# EAGLE design schematics (EAGLE 9.5.2)
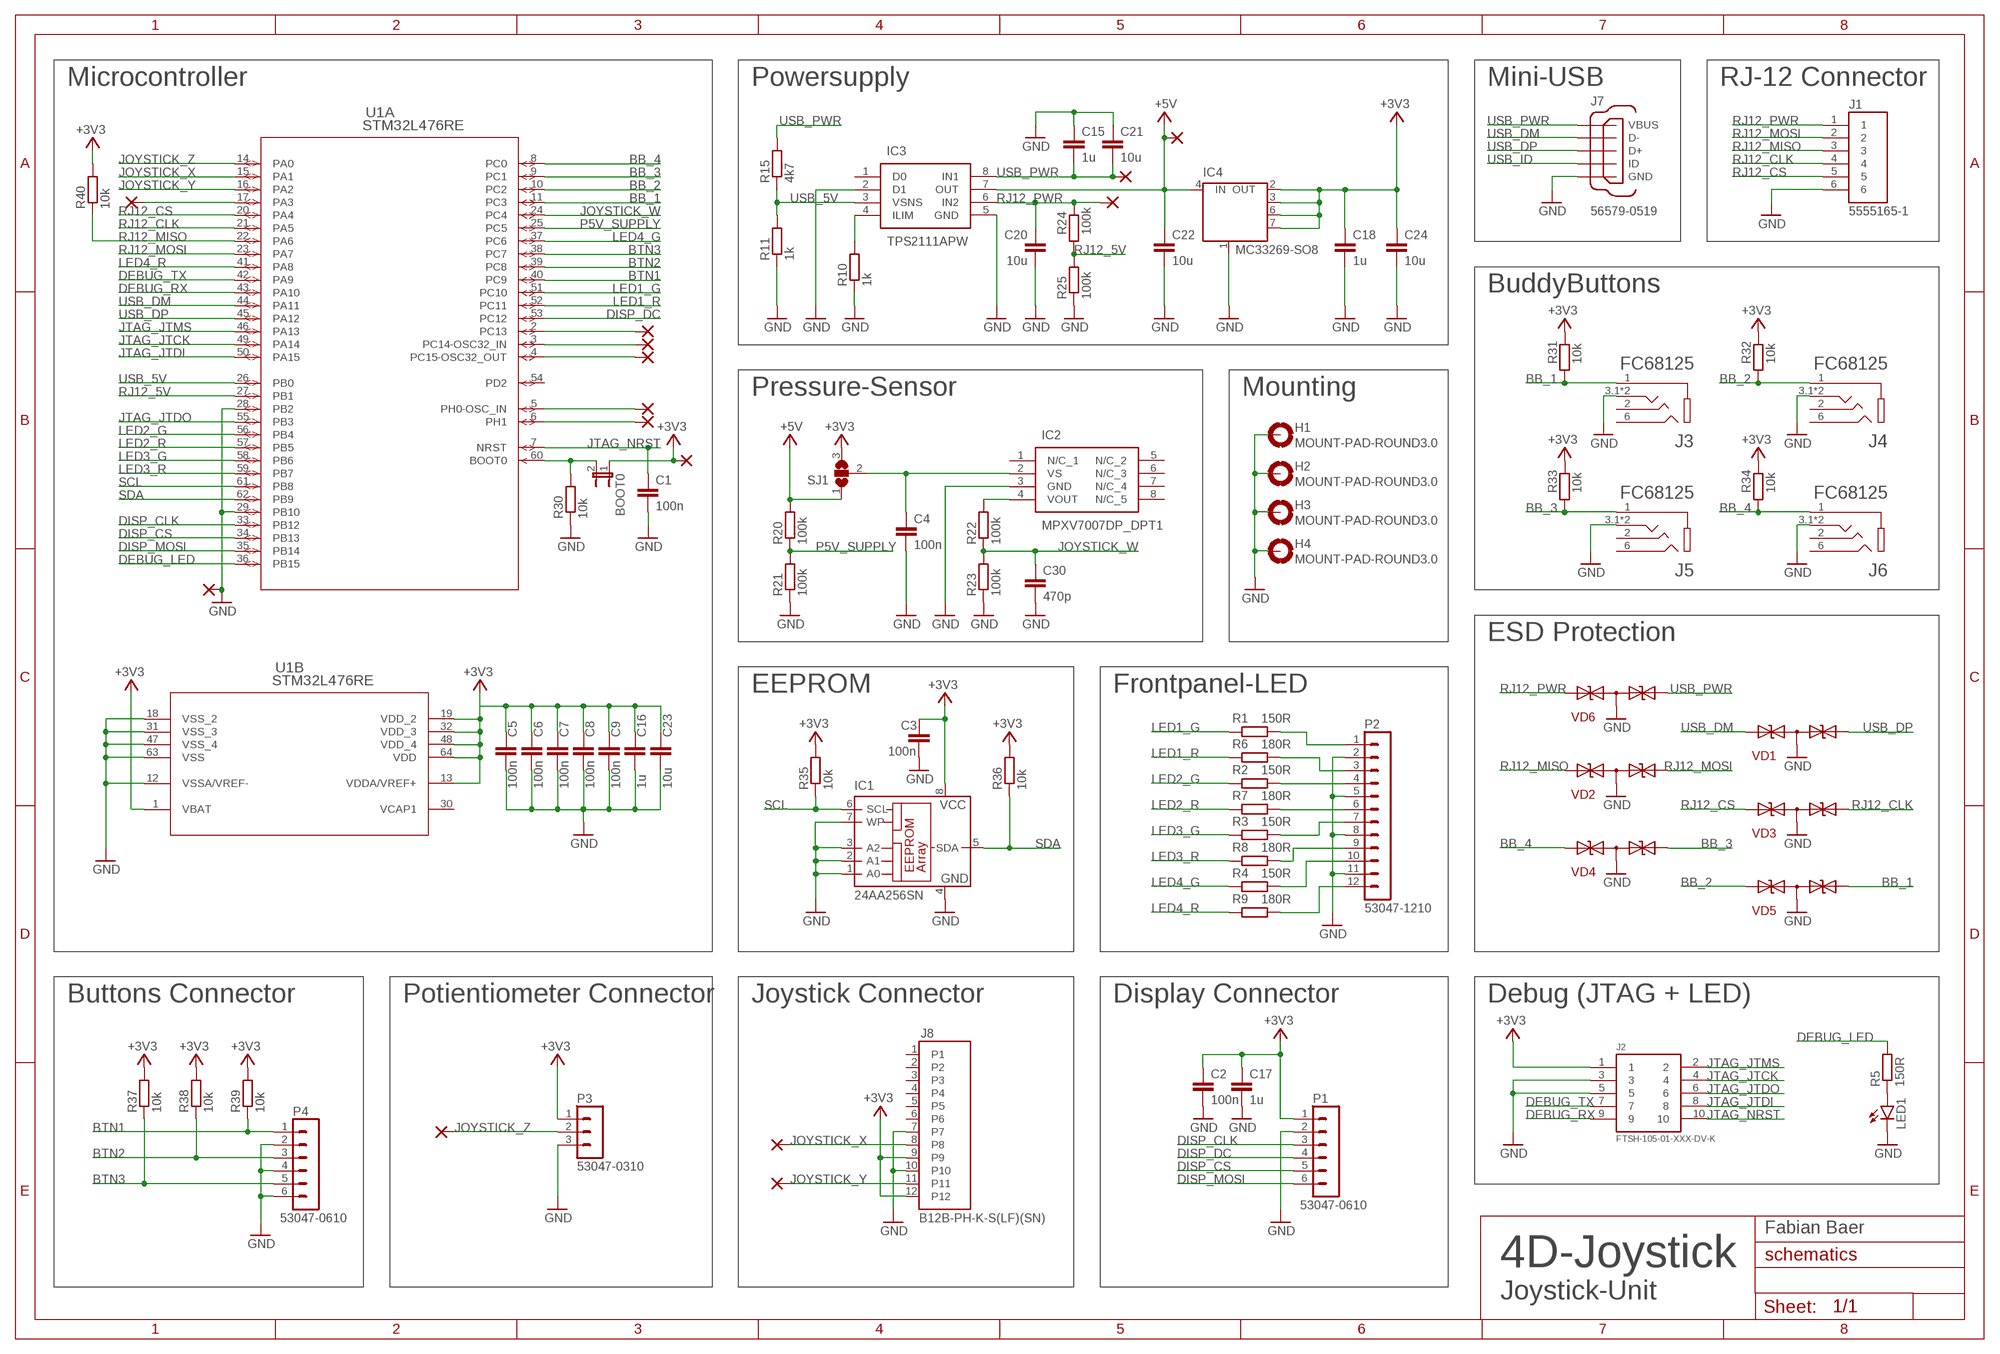
[diagram p0: schematic, sheet 1]

## Parts
BOOT0  JP1E  [JP1]
C1  100n  C-EUC0603  [C0603]
C2  100n  C-EUC0603  [C0603]
C3  100n  C-EUC0603  [C0603]
C4  100n  C-EUC0603  [C0603]
C5  100n  C-EUC0603  [C0603]
C6  100n  C-EUC0603  [C0603]
C7  100n  C-EUC0603  [C0603]
C8  100n  C-EUC0603  [C0603]
C9  100n  C-EUC0603  [C0603]
C15  1u  C-EUC0603  [C0603]
C16  1u  C-EUC0603  [C0603]
C17  1u  C-EUC0603  [C0603]
C18  1u  C-EUC0603  [C0603]
C20  10u  C-EUC0603  [C0603]
C21  10u  C-EUC0603  [C0603]
C22  10u  C-EUC0603  [C0603]
C23  10u  C-EUC0603  [C0603]
C24  10u  C-EUC0603  [C0603]
C30  470p  C-EUC0603  [C0603]
H1  MOUNT-PAD-ROUND3.0  [3,0-PAD]
H2  MOUNT-PAD-ROUND3.0  [3,0-PAD]
H3  MOUNT-PAD-ROUND3.0  [3,0-PAD]
H4  MOUNT-PAD-ROUND3.0  [3,0-PAD]
IC1  24AA256SN  [SO-08]
IC2  MPXV7007DP_DPT1  [MPXV7007DPDPT1]
IC3  TPS2111APW  [SOP65P640X120-8N]
IC4  MC33269-SO8  [SO08]
J1  5555165-1  [TE_5555165-1]
J2  FTSH-105-01-XXX-DV-K  [FTSH-105-01-XXX-DV-K]
J3  FC68125  [CLIFF_FC68125]
J4  FC68125  [CLIFF_FC68125]
J5  FC68125  [CLIFF_FC68125]
J6  FC68125  [CLIFF_FC68125]
J7  56579-0519  [MOLEX_56579-0519]
J8  B12B-PH-K-S(LF)(SN)  [JST_B12B-PH-K-S(LF)(SN)]
LED1  LEDSML0603  [SML0603]
P1  53047-0610  [53047-0610]
P2  53047-1210  [53047-1210]
P3  53047-0310  [53047-0310]
P4  53047-0610  [53047-0610]
PAD1  WIREPAD1,6/0,9  [1,6/0,9]
PAD2  WIREPAD1,6/0,9  [1,6/0,9]
PAD3  WIREPAD1,6/0,9  [1,6/0,9]
PAD4  WIREPAD1,6/0,9  [1,6/0,9]
PAD5  WIREPAD1,6/0,9  [1,6/0,9]
PAD6  WIREPAD1,6/0,9  [1,6/0,9]
PAD7  WIREPAD1,6/0,9  [1,6/0,9]
PAD8  WIREPAD1,6/0,9  [1,6/0,9]
PAD9  WIREPAD1,6/0,9  [1,6/0,9]
PAD10  WIREPAD1,6/0,9  [1,6/0,9]
PAD11  WIREPAD1,6/0,9  [1,6/0,9]
PAD12  WIREPAD1,6/0,9  [1,6/0,9]
PAD13  WIREPAD1,6/0,9  [1,6/0,9]
PAD14  WIREPAD1,6/0,9  [1,6/0,9]
R1  150R  R-EU_R0603  [R0603]
R2  150R  R-EU_R0603  [R0603]
R3  150R  R-EU_R0603  [R0603]
R4  150R  R-EU_R0603  [R0603]
R5  150R  R-EU_R0603  [R0603]
R6  180R  R-EU_R0603  [R0603]
R7  180R  R-EU_R0603  [R0603]
R8  180R  R-EU_R0603  [R0603]
R9  180R  R-EU_R0603  [R0603]
R10  1k  R-EU_R0603  [R0603]
R11  1k  R-EU_R0603  [R0603]
R15  4k7  R-EU_R0603  [R0603]
R20  100k  R-EU_R0603  [R0603]
R21  100k  R-EU_R0603  [R0603]
R22  100k  R-EU_R0603  [R0603]
R23  100k  R-EU_R0603  [R0603]
R24  100k  R-EU_R0603  [R0603]
R25  100k  R-EU_R0603  [R0603]
R30  10k  R-EU_R0603  [R0603]
R31  10k  R-EU_R0603  [R0603]
R32  10k  R-EU_R0603  [R0603]
R33  10k  R-EU_R0603  [R0603]
R34  10k  R-EU_R0603  [R0603]
R35  10k  R-EU_R0603  [R0603]
R36  10k  R-EU_R0603  [R0603]
R37  10k  R-EU_R0603  [R0603]
R38  10k  R-EU_R0603  [R0603]
R39  10k  R-EU_R0603  [R0603]
R40  10k  R-EU_R0603  [R0603]
SJ1  SJ2W  [SJ_2]
U1  STM32L476RE  STM32F4X1R1  [LQFP64-10X10MM]
VD1  PGB102ST23WR  [SOT23]
VD2  PGB102ST23WR  [SOT23]
VD3  PGB102ST23WR  [SOT23]
VD4  PGB102ST23WR  [SOT23]
VD5  PGB102ST23WR  [SOT23]
VD6  PGB102ST23WR  [SOT23]

## Nets
+3V3: BOOT0.1 C2.1 C3.1 C5.1 C6.1 C7.1 C8.1 C9.1 C16.1 C17.1 C18.1 C23.1 C24.1 IC1.8(VCC) IC4.2(OUT) IC4.3(OUT) IC4.6(OUT) IC4.7(OUT) J2.1 J8.9 J8.12 P1.1 P3.1 PAD7.1(P) R31.2 R32.2 R33.2 R34.2 R35.2 R36.2 R37.2 R38.2 R39.2 R40.2 SJ1.3 U1.1(B:VBAT) U1.13(B:VDDA/VREF+) U1.19(B:VDD_2) U1.32(B:VDD_3) U1.48(B:VDD_4) U1.64(B:VDD)
+5V: C22.1 IC3.7(OUT) IC4.4(IN) PAD9.1(P) R20.2 SJ1.1
BB_1: J3.1(1S) R31.1 U1.11(A:PC3) VD5.1(A)
BB_2: J4.1(1S) R32.1 U1.10(A:PC2) VD5.2(A1)
BB_3: J5.1(1S) R33.1 U1.9(A:PC1) VD4.1(A)
BB_4: J6.1(1S) R34.1 U1.8(A:PC0) VD4.2(A1)
BTN1: P4.1 R39.1 U1.40(A:PC9)
BTN2: P4.3 R38.1 U1.39(A:PC8)
BTN3: P4.5 R37.1 U1.38(A:PC7)
DEBUG_LED: R5.2 U1.36(A:PB15)
DEBUG_RX: J2.9 U1.43(A:PA10)
DEBUG_TX: J2.7 U1.42(A:PA9)
DISP_CLK: P1.3 U1.33(A:PB12)
DISP_CS: P1.5 U1.34(A:PB13)
DISP_DC: P1.4 U1.53(A:PC12)
DISP_MOSI: P1.6 U1.35(A:PB14)
GND: C1.2 C2.2 C3.2 C4.2 C5.2 C6.2 C7.2 C8.2 C9.2 C15.1 C16.2 C17.2 C18.2 C20.2 C21.1 C22.2 C23.2 C24.2 C30.2 H1.B3,0(MOUNT) H2.B3,0(MOUNT) H3.B3,0(MOUNT) H4.B3,0(MOUNT) IC1.1(A0) IC1.2(A1) IC1.3(A2) IC1.4(GND) IC1.7(WP) IC2.3(GND) IC3.2(D1) IC3.5(GND) IC4.1(GND/ADJ) J1.6 J2.3 J2.5 J3.3.1(3T) J3.3.2(3T) J4.3.1(3T) J4.3.2(3T) J5.3.1(3T) J5.3.2(3T) J6.3.1(3T) J6.3.2(3T) J7.5(GND) J8.7 J8.10 LED1.C P1.2 P2.2 P2.5 P2.8 P2.11 P3.3 P4.2 P4.4 P4.6 PAD8.1(P) R10.1 R11.1 R21.1 R23.1 R25.1 R30.1 U1.12(B:VSSA/VREF-) U1.18(B:VSS_2) U1.28(A:PB2) U1.29(A:PB10) U1.31(B:VSS_3) U1.47(B:VSS_4) U1.63(B:VSS) VD1.3(C) VD2.3(C) VD3.3(C) VD4.3(C) VD5.3(C) VD6.3(C)
JOYSTICK_W: C30.1 R22.1 R23.2 U1.24(A:PC4)
JOYSTICK_X: J8.8 PAD12.1(P) U1.15(A:PA1)
JOYSTICK_Y: J8.11 PAD13.1(P) U1.16(A:PA2)
JOYSTICK_Z: P3.2 PAD14.1(P) U1.14(A:PA0)
JTAG_JTCK: J2.4 U1.49(A:PA14)
JTAG_JTDI: J2.8 U1.50(A:PA15)
JTAG_JTDO: J2.6 U1.55(A:PB3)
JTAG_JTMS: J2.2 U1.46(A:PA13)
JTAG_NRST: C1.1 J2.10 U1.7(A:NRST)
LED1_G: R1.2 U1.51(A:PC10)
LED1_R: R6.2 U1.52(A:PC11)
LED2_G: R2.2 U1.56(A:PB4)
LED2_R: R7.2 U1.57(A:PB5)
LED3_G: R3.2 U1.58(A:PB6)
LED3_R: R8.2 U1.59(A:PB7)
LED4_G: R4.2 U1.37(A:PC6)
LED4_R: R9.2 U1.41(A:PA8)
N$1: BOOT0.2 R30.2 U1.60(A:BOOT0)
N$3: C4.1 IC2.2(VS) SJ1.2
N$4: IC2.4(VOUT) R22.2
N$5: LED1.A R5.1
N$6: PAD1.1(P) U1.6(A:PH1)
N$7: PAD2.1(P) U1.5(A:PH0-OSC_IN)
N$8: PAD3.1(P) U1.2(A:PC13)
N$9: PAD4.1(P) U1.3(A:PC14-OSC32_IN)
N$10: IC3.4(ILIM) R10.2
N$11: P2.12 R9.1
N$12: PAD5.1(P) U1.4(A:PC15-OSC32_OUT)
N$13: P2.10 R4.1
N$14: P2.9 R8.1
N$15: P2.7 R3.1
N$16: P2.6 R7.1
N$17: P2.4 R2.1
N$18: P2.3 R6.1
N$19: P2.1 R1.1
N$20: PAD6.1(P) U1.17(A:PA3)
P5V_SUPPLY: R20.1 R21.2 U1.25(A:PC5)
RJ12_5V: R24.1 R25.2 U1.27(A:PB1)
RJ12_CLK: J1.4 U1.21(A:PA5) VD3.1(A)
RJ12_CS: J1.5 U1.20(A:PA4) VD3.2(A1)
RJ12_MISO: J1.3 R40.1 U1.22(A:PA6) VD2.2(A1)
RJ12_MOSI: J1.2 U1.23(A:PA7) VD2.1(A)
RJ12_PWR: C20.1 IC3.6(IN2) J1.1 PAD11.1(P) R24.2 VD6.2(A1)
SCL: IC1.6(SCL) R35.1 U1.61(A:PB8)
SDA: IC1.5(SDA) R36.1 U1.62(A:PB9)
USB_5V: IC3.3(VSNS) R11.2 R15.1 U1.26(A:PB0)
USB_DM: J7.2(D-) U1.44(A:PA11) VD1.2(A1)
USB_DP: J7.3(D+) U1.45(A:PA12) VD1.1(A)
USB_ID: J7.4(ID)
USB_PWR: C15.2 C21.2 IC3.8(IN1) J7.1(VBUS) PAD10.1(P) R15.2 VD6.1(A)
Unconnected: IC2.1(N/C_1) IC2.5(N/C_2) IC2.6(N/C_3) IC2.7(N/C_4) IC2.8(N/C_5) IC3.1(D0) J3.2(2R) J3.6(6SR) J4.2(2R) J4.6(6SR) J5.2(2R) J5.6(6SR) J6.2(2R) J6.6(6SR) J8.1 J8.2 J8.3 J8.4 J8.5 J8.6 U1.54(A:PD2)

## Notes on the sheet
- Microcontroller | Powersupply | Mini-USB | RJ-12 Connector
- BuddyButtons
- Pressure-Sensor | Mounting
- ESD Protection
- EEPROM | Frontpanel-LED
- Buttons Connector | Potientiometer Connector | Joystick Connector | Display Connector | Debug (JTAG + LED)
- Fabian Baer
- 4D-Joystick
- Joystick-Unit

## Power pins joined to a net without a drawn wire
VCAP1: U1.30(B:VCAP1)

## Library data of the parts
BOOT0 = jumper:JP1E: JUMPER
C1-C9 C15-C18 C20-C24 C30 = rcl:C-EU: CAPACITOR, European symbol; SPICEPREFIX: C
H1-H4 = holes:MOUNT-PAD-ROUND: MOUNTING PAD, round
IC1 = microchip:24*: Serial EEPROM I2C; MPN: 24AA256T-I/SM; OC_FARNELL: 1579570; OC_NEWARK: 08N6838
IC2 = MPXV7007DP_DPT1:MPXV7007DP_DPT1: Integrated Silicon Pressure Sensor On-Chip Signal Conditioned, Temperature Compensated and Calibrated. 5.0% Maximum Error Over 0 to 85C Ideally Suited for Microprocessor or Microcontroller-Based Systems Temperature Compensated Over 40 to +125C Thermoplastic (PPS) Surface Mount Package Patented Silicon Shear Stress Strain Gauge Available in Differential and Gauge Configurations Source: Datasheet <https://www.nxp.com/docs/en/data-sheet/MPXV7007.pdf>; DESCRIPTION: Integrated Silicon Pressure Sensor On-Chip Signal Conditioned, Temperature Compensated and Calibrated. 5.0% Maximum Error Over 0 to 85C Ideally Suited for Microprocessor or Microcontroller-Based Systems Temperature Compensated Over 40 to +125C Thermoplastic (PPS) Surface Mount Package Patented Silicon Shear Stress Strain Gauge Available in Differential and Gauge Configurations; HEIGHT: 9.65mm; MANUFACTURER_NAME: Nexperia; MANUFACTURER_PART_NUMBER: MPXV7007DP/DPT1
IC3 = TPS2111APW:TPS2111APW: Pwr Mux Autoswitch 2.8V to 5.5V 1A Texas Instruments TPS2111A, Power Multiplexer Autoswitching 1A 5.5 V max. 8-Pin TSSOP Source: Datasheet <http://www.ti.com/lit/ds/symlink/tps2111a.pdf>; DESCRIPTION: Pwr Mux Autoswitch 2.8V to 5.5V 1A Texas Instruments TPS2111A, Power Multiplexer Autoswitching 1A 5.5 V max. 8-Pin TSSOP; HEIGHT: 1.2mm; MANUFACTURER_NAME: Texas Instruments; MANUFACTURER_PART_NUMBER: TPS2111APW; MOUSER_PART_NUMBER: 595-TPS2111APW; MOUSER_PRICE-STOCK: https://www.mouser.com/Search/Refine.aspx?Keyword=595-TPS2111APW; RS_PART_NUMBER: 6658866P; RS_PRICE-STOCK: http://uk.rs-online.com/web/p/products/6658866P
IC4 = linear:MC33269-SO8: Adjustable Output Low Dropout Voltage Regulator 800 mA Source: http://www.onsemi.com/pub/Collateral/MC33269-D.PDF
J1 = 5555165-1:5555165-1: CONN MOD JACK 6P6C R/A UNSHLD; AVAILABILITY: Unavailable; CENTERLINE_PITCH: 1.02 mm[.04 in]; COMMENT: 5555165-1; DESCRIPTION: Conn RJ-25 F 6 POS 2.54mm Solder RA Thru-Hole 6 Terminal 1 Port Cat 3 Box/Package/Tray; EU_ROHS_COMPLIANCE: Compliant; MF: TE Connectivity; MP: 5555165-1; NUMBER_OF_POSITIONS: 6; PACKAGE: None; PRICE: None; TE_PURCHASE_URL: https://www.te.com/usa-en/product-5555165-1.html?te_bu=Cor&te_type=disp&te_campaign=seda_glo_cor-seda-global-disp-prtnr-fy19-seda-model-bom-cta_sma-317_1&elqCampaignId=32493
J2 = FTSH-105-01-XXX-DV-K:FTSH-105-01-XXX-DV-K: 0.05"x0.05" DOUBLE ROW SMT STRIP ASSEMBLY. MANUFACTURER:SAMTEC.
J3-J6 = FC68125:FC68125: CONNECTOR, PHONO, 3.5MM, JACK, 4POLE; Gender: Receptacle; No. of Contacts: 4; Cont; AVAILABILITY: Unavailable; DESCRIPTION: 3.5mm 4 Pole Jack Sockets; MF: Cliff Electronics; MP: FC68125; PACKAGE: Package Analog Devices; PRICE: None
J7 = 56579-0519:56579-0519: USB On-The-Go (OTG) Mini-AB Receptacle, Right Angle, Through Hole Solder Tails and Shell Tabs, Lead-Free; AVAILABILITY: Unavailable; DESCRIPTION: USB On-The-Go _OTG_ Mini-AB Receptacle, Right Angle, Through Hole Solder Tails and Shell Tabs, Lead-Free; MF: Molex; MP: 56579-0519; PACKAGE: None; PRICE: None
J8 = B12B-PH-K-S_LF__SN_:B12B-PH-K-S(LF)(SN): PH Series 12 Position 2 mm Pitch Through hole Shrouded Header; AVAILABILITY: Unavailable; DESCRIPTION: PH Series 12 Position 2 mm Pitch Through hole Shrouded Header; MF: JST Sales; MP: B12B-PH-K-S_LF__SN_; PACKAGE: None; PRICE: None
LED1 = led:LED: LED OSRAM: - CHIPLED LG R971, LG N971, LY N971, LG Q971, LY Q971, LO R971, LY R971 LH N974, LH R974 LS Q976, LO Q976, LY Q976 LO Q996 - Hyper CHIPLED LW Q18S LB Q993, LB Q99A, LB R99A - SideLED LS A670, LO A670, LY A670, LG A670, LP A670 LB A673, LV A673, LT A673, LW A673 LH A674 LY A675 LS A676, LA A676, LO A676, LY A676, LW A676 LS A679, LY A679, LG A679 - Hyper Micro SIDELED® LS Y876, LA Y876, LO Y876, LY Y876 LT Y87S - SmartLED LW L88C, LW L88S LB L89C, LB L89S, LG L890 LS L89K, LO L89K, LY L89K LS L896, LA L896, LO L896, LY L896 - TOPLED LS T670, LO T670, LY T670, LG T670, LP T670 LSG T670, LSP T670, LSY T670, LOP T670, LYG T670 LG T671, LOG T671, LSG T671 LB T673, LV T673, LT T673, LW T673 LH T674 LS T676, LA T676, LO T676, LY T676, LB T676, LH T676, LSB T676, LW T676 LB T67C, LV T67C, LT T67C, LS T67K, LO T67K, LY T67K, LW E67C LS E67B, LA E67B, LO E67B, LY E67B, LB E67C, LV E67C, LT E67C LW T67C LS T679, LY T679, LG T679 LS T770, LO T770, LY T770, LG T770, LP T770 LB T773, LV T773, LT T773, LW T773 LH T774 LS E675, LA E675, LY E675, LS T675 LS T776, LA T776, LO T776, LY T776, LB T776 LHGB T686 LT T68C, LB T68C - Hyper Mini TOPLED® LB M676 - Mini TOPLED Santana® LG M470 LS M47K, LO M47K, LY M47K Source: http://www.osram.convergy.de LUXEON: - LUMILED® LXK2-PW12-R00, LXK2-PW12-S00, LXK2-PW14-U00, LXK2-PW14-V00 LXK2-PM12-R00, LXK2-PM12-S00, LXK2-PM14-U00 LXK2-PE12-Q00, LXK2-PE12-R00, LXK2-PE12-S00, LXK2-PE14-T00, LXK2-PE14-U00 LXK2-PB12-K00, LXK2-PB12-L00, LXK2-PB12-M00, LXK2-PB14-N00, LXK2-PB14-P00, LXK2-PB14-Q00 LXK2-PR12-L00, LXK2-PR12-M00, LXK2-PR14-Q00, LXK2-PR14-R00 LXK2-PD12-Q00, LXK2-PD12-R00, LXK2-PD12-S00 LXK2-PH12-R00, LXK2-PH12-S00 LXK2-PL12-P00, LXK2-PL12-Q00, LXK2-PL12-R00 Source: www.luxeon.com KINGBRIGHT: KA-3528ASYC Source: www.kingbright.com
P1 P4 = molex_microblade:53047-0610: HEADER
P2 = molex_microblade:53047-1210: HEADER
P3 = molex_microblade:53047-0310: HEADER
PAD1-PAD14 = wirepad:WIREPAD: Wire PAD connect wire on PCB
R1-R11 R15 R20-R25 R30-R40 = rcl:R-EU_: RESISTOR, European symbol; SPICEPREFIX: R
SJ1 = jumper:SJ2W: SMD solder JUMPER
U1 = stm32f411re:STM32F4X1R1; MANUFACTURER_PART_NUMBER: STM32F4X1R1; VENDOR: STMicroelectronics
VD1-VD6 = diodes-zener:PGB102ST23WR; MOUSER: 576-PGB102ST23WR

## Board
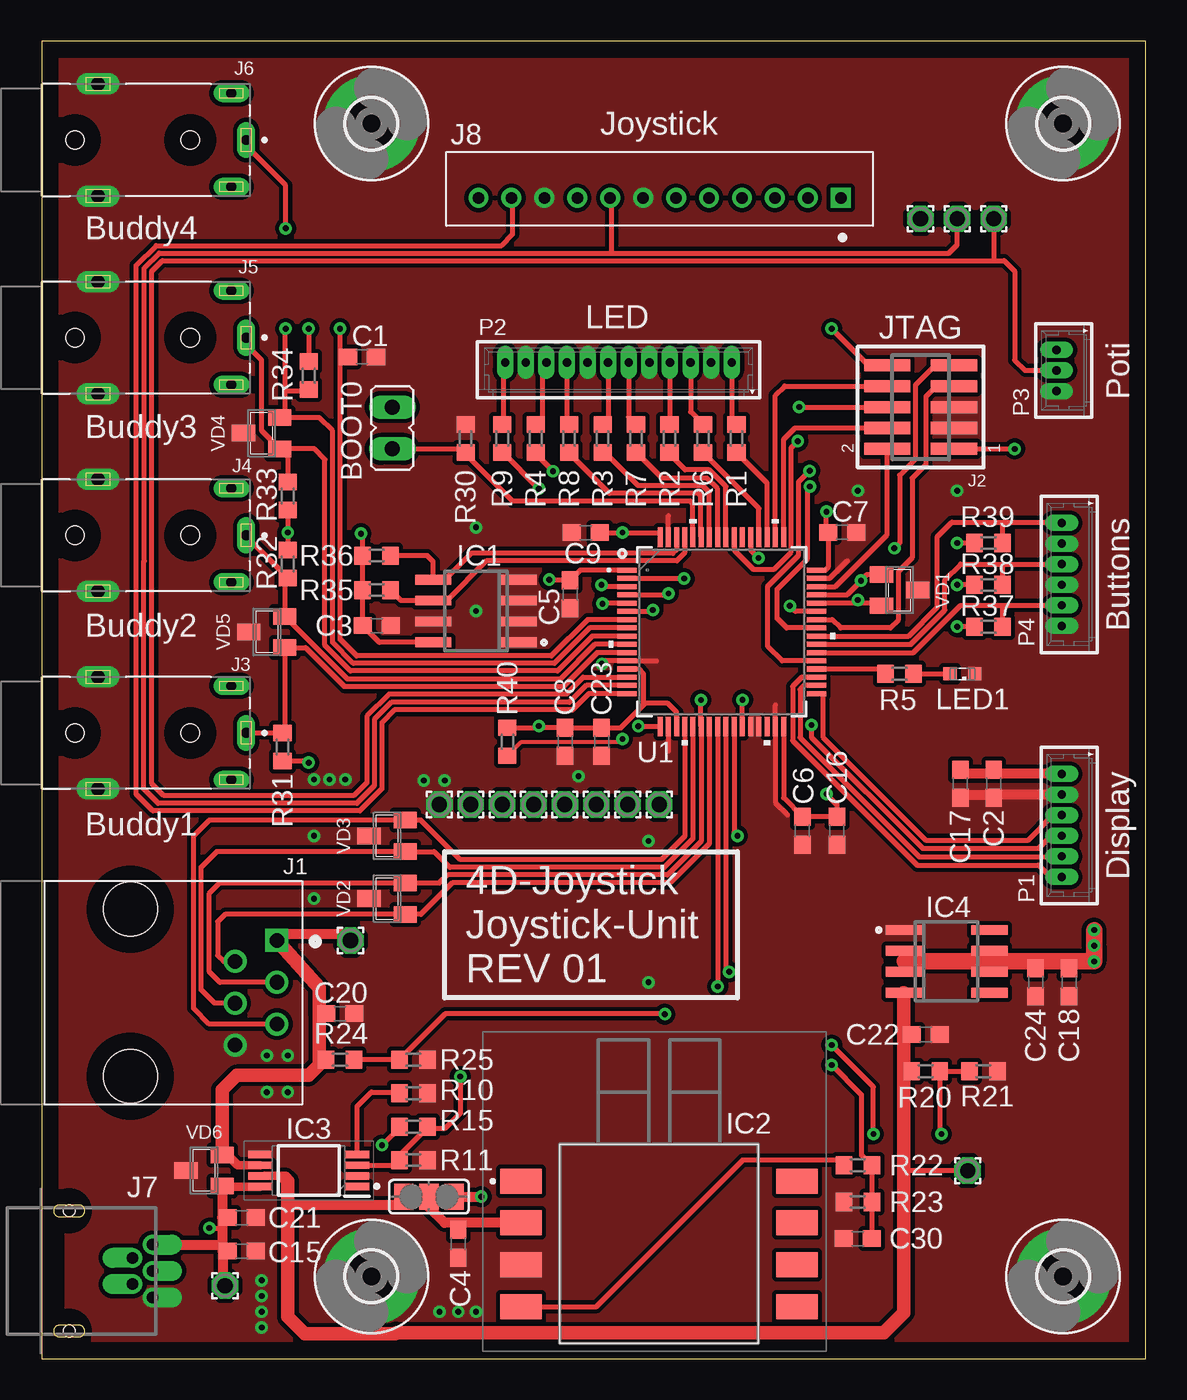
[diagram p1: board, top side]
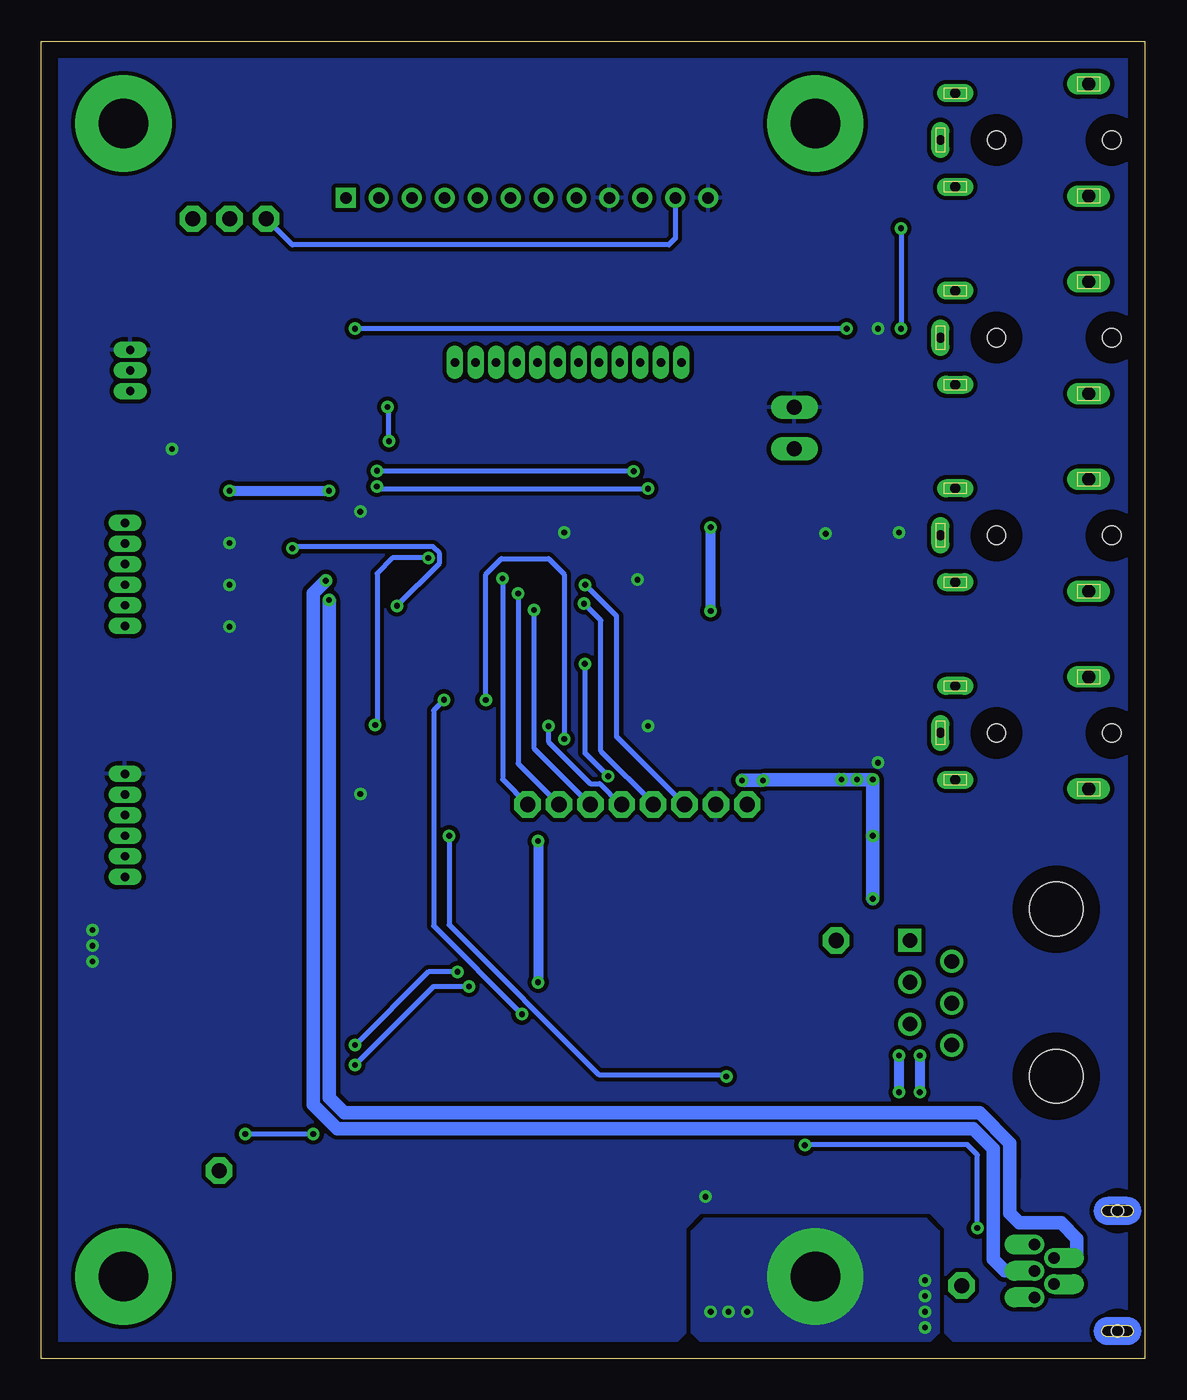
[diagram p2: board, bottom side, seen from below]

Size 67 x 80 mm. Coordinates in mm from the lower left corner, seen from the top.
Outline: 0,0 67,0 67,80 0,80 0,0
Copper layers (1*16): Top 0.035mm / dielectric 1.6mm / Bottom 0.035mm
Design rules "default *": minimum track width 6mil, minimum drill 0.35mm, track to track 6mil, track to pad 6mil, pad to pad 6mil, via to via 6mil, smd to smd 6mil, copper to edge 40mil, drill to drill 6mil, minimum pad ring 10mil, minimum via ring 8mil, stop-mask expansion 2mil, vias tented up to drill 0mil, thermal gap 10mil

### Footprints (pad centres in the part's own frame; a part is rotated, then mirrored left to right if it is on the bottom)
JP1 = drill 0.914 long: 1 0,-1.27; 2 0,1.27
C0603 = smd 1.1 x 1: 1 -0.85,0; 2 0.85,0
3,0-PAD = drill 3 pad 5.842: B3,0 0,0
SO-08 = smd 0.6 x 2.2: 1 -1.905,-2.6; 2 -0.635,-2.6; 3 0.635,-2.6; 4 1.905,-2.6; 5 1.905,2.6; 6 0.635,2.6; 7 -0.635,2.6; 8 -1.905,2.6
MPXV7007DPDPT1 = smd 2.54 x 1.52: 1 8.38,-3.81; 2 8.38,-1.27; 3 8.38,1.27; 4 8.38,3.81; 5 -8.38,3.81; 6 -8.38,1.27; 7 -8.38,-1.27; 8 -8.38,-3.81
SOP65P640X120-8N = smd 1.475 x 0.45: 1 -2.938,0.975; 2 -2.938,0.325; 3 -2.938,-0.325; 4 -2.938,-0.975; 5 2.938,-0.975; 6 2.938,-0.325; 7 2.938,0.325; 8 2.938,0.975
SO08 = smd 0.6 x 2.2: 1 -1.905,-2.6; 2 -0.635,-2.6; 3 0.635,-2.6; 4 1.905,-2.6; 5 1.905,2.6; 6 0.635,2.6; 7 -0.635,2.6; 8 -1.905,2.6
TE_5555165-1 = drill 0.89 square: 1 0,0 | drill 0.89: 2 1.27,-2.54; 3 2.54,0; 4 3.81,-2.54; 5 5.08,0; 6 6.35,-2.54 | hole 3.25: -1.91,-8.89; 8.25,-8.89
FTSH-105-01-XXX-DV-K = smd 0.737 x 2.794: 1 -2.54,-2.032; 2 -2.54,2.032; 3 -1.27,-2.032; 4 -1.27,2.032; 5 0,-2.032; 6 0,2.032; 7 1.27,-2.032; 8 1.27,2.032; 9 2.54,-2.032; 10 2.54,2.032
CLIFF_FC68125 = drill 0.6 long: 1 0,3.4; 2 -2.85,2.5; 6 2.85,2.5 | drill 0.8 long: 3.1 -3.4,-5.6; 3.2 3.4,-5.6 | hole 1.1: 0,0; 0,-7
MOLEX_56579-0519 = drill 0.7 pad 0.9 offset: 1 5.05,1.6; 2 3.85,0.8; 3 5.05,0; 4 3.85,-0.8; 5 5.05,-1.6 | hole 0.7: 0,3.65; 0,-3.65
JST_B12B-PH-K-S(LF)(SN) = drill 0.7 square: 1 0,0 | drill 0.7: 2 2,0; 3 4,0; 4 6,0; 5 8,0; 6 10,0; 7 12,0; 8 14,0; 9 16,0; 10 18,0; 11 20,0; 12 22,0
SML0603 = smd 0.8 x 0.8: A 0.75,0; C -0.75,0
53047-0610 = drill 0.508 long: 1 3.125,0; 2 1.875,0; 3 0.625,0; 4 -0.625,0; 5 -1.875,0; 6 -3.125,0
53047-1210 = drill 0.508 long: 1 6.875,0; 2 5.625,0; 3 4.375,0; 4 3.125,0; 5 1.875,0; 6 0.625,0; 7 -0.625,0; 8 -1.875,0; 9 -3.125,0; 10 -4.375,0; 11 -5.625,0; 12 -6.875,0
53047-0310 = drill 0.508 long: 1 1.25,0; 2 0,0; 3 -1.25,0
1,6/0,9 = drill 0.914 pad 1.6 octagon: 1 0,0
R0603 = smd 1 x 1.1: 1 -0.85,0; 2 0.85,0
SJ_2 = smd 1.168 x 1.6: 1 -1.524,0; 2 0,0; 3 1.524,0
LQFP64-10X10MM = smd 1.194 x 0.305: 1 -5.75,3.75; 2 -5.75,3.25; 3 -5.75,2.75; 4 -5.75,2.25; 5 -5.75,1.75; 6 -5.75,1.25; 7 -5.75,0.75; 8 -5.75,0.25; 9 -5.75,-0.25; 10 -5.75,-0.75; 11 -5.75,-1.25; 12 -5.75,-1.75; 13 -5.75,-2.25; 14 -5.75,-2.75; 15 -5.75,-3.25; 16 -5.75,-3.75; 33 5.75,-3.75; 34 5.75,-3.25; 35 5.75,-2.75; 36 5.75,-2.25; 37 5.75,-1.75; 38 5.75,-1.25; 39 5.75,-0.75; 40 5.75,-0.25; 41 5.75,0.25; 42 5.75,0.75; 43 5.75,1.25; 44 5.75,1.75; 45 5.75,2.25; 46 5.75,2.75; 47 5.75,3.25; 48 5.75,3.75 | smd 0.305 x 1.194: 17 -3.75,-5.75; 18 -3.25,-5.75; 19 -2.75,-5.75; 20 -2.25,-5.75; 21 -1.75,-5.75; 22 -1.25,-5.75; 23 -0.75,-5.75; 24 -0.25,-5.75; 25 0.25,-5.75; 26 0.75,-5.75; 27 1.25,-5.75; 28 1.75,-5.75; 29 2.25,-5.75; 30 2.75,-5.75; 31 3.25,-5.75; 32 3.75,-5.75; 49 3.75,5.75; 50 3.25,5.75; 51 2.75,5.75; 52 2.25,5.75; 53 1.75,5.75; 54 1.25,5.75; 55 0.75,5.75; 56 0.25,5.75; 57 -0.25,5.75; 58 -0.75,5.75; 59 -1.25,5.75; 60 -1.75,5.75; 61 -2.25,5.75; 62 -2.75,5.75; 63 -3.25,5.75; 64 -3.75,5.75
SOT23 = smd 1 x 1.4: 1 -0.95,-1.1; 2 0.95,-1.1; 3 0,1.1

### Placement (x,y rotation side)
BOOT0  21.27,56.52 180 top
C1  19.43,60.83 0 top
C2  57.78,34.92 270 top
C3  20.32,44.51 0 top
C4  25.27,6.99 270 top
C5  32.07,46.42 270 top
C6  46.16,32.07 270 top
C7  48.58,50.16 0 top
C8  31.75,37.47 270 top
C9  33.02,50.16 180 top
C15  12.13,6.54 180 top
C16  48.26,32.07 270 top
C17  55.75,34.92 270 top
C18  62.36,22.86 270 top
C20  18.1,20.95 0 top
C21  12.13,8.57 180 top
C22  53.66,19.68 0 top
C23  33.97,37.47 270 top
C24  60.33,22.86 270 top
C30  49.53,7.3 180 top
H1  62,5 0 top
H2  62,75 0 top
H3  20,75 0 top
H4  20,5 0 top
IC1  26.35,45.4 90 top
IC2  37.47,6.99 180 top
IC3  16.19,11.43 180 top
IC4  54.93,24.13 270 top
J1  14.26,25.4 270 top
J2  53.34,57.78 90 top
J3  9,38 270 top
J4  9,50 270 top
J5  9,62 270 top
J6  9,74 270 top
J7  1.65,5.33 0 top
J8  48.5,70.48 180 top
LED1  55.88,41.59 180 top
P1  61.91,32.38 90 top
P2  35,60.5 0 top
P3  61.59,60.01 90 top
P4  61.91,47.62 90 top
PAD1  33.66,33.66 0 top
PAD2  29.84,33.66 0 top
PAD3  37.47,33.66 0 top
PAD4  27.94,33.66 0 top
PAD5  35.56,33.66 0 top
PAD6  31.75,33.66 0 top
PAD7  26.04,33.66 0 top
PAD8  24.13,33.66 0 top
PAD9  56.2,11.43 0 top
PAD10  11.11,4.45 0 top
PAD11  18.73,25.4 0 top
PAD12  55.56,69.22 0 top
PAD13  53.34,69.22 0 top
PAD14  57.78,69.22 0 top
R1  42.16,55.88 270 top
R2  38.1,55.88 270 top
R3  34.04,55.88 270 top
R4  29.97,55.88 270 top
R5  52.07,41.59 180 top
R6  40.13,55.88 270 top
R7  36.07,55.88 270 top
R8  32,55.88 270 top
R9  27.94,55.88 270 top
R10  22.54,16.13 180 top
R11  22.54,12.06 180 top
R15  22.54,14.1 180 top
R20  53.66,17.46 180 top
R21  57.15,17.46 180 top
R22  49.53,11.75 180 top
R23  49.53,9.53 0 top
R24  18.1,18.16 180 top
R25  22.54,18.16 180 top
R30  25.72,55.88 270 top
R31  14.61,37.15 270 top
R32  14.92,48.26 90 top
R33  14.92,52.39 270 top
R34  16.19,59.69 90 top
R35  20.32,46.67 180 top
R36  20.32,48.77 180 top
R37  57.47,44.45 180 top
R38  57.47,46.99 180 top
R39  57.47,49.53 180 top
R40  28.26,37.47 90 top
SJ1  23.5,9.84 0 top
U1  41.27,44.13 0 top
VD1  52.07,46.67 270 top
VD2  20.95,27.94 90 top
VD3  20.95,31.75 90 top
VD4  13.34,56.2 90 top
VD5  13.65,44.13 90 top
VD6  9.84,11.43 90 top

### Tracks (layer width: path | path; a pad name or v marks a point on that pad's centre or on a via)
+3V3  (via drill 0.35)
  Top 0.305: IC1.8 20.49,43.5 C3.1 R35.2 R36.2 19.47,50 v19.37,50.1 | U1.1 32.68,47.88 C5.1 30.84,47.27 v30.8,47.31 | R32.2 v14.92,50.16 R33.2 | R31.2 16.09,36.3 v16.19,36.2 | U1.32 45.02,34.06 C6.1 C16.1 48.26,33.66 v47.62,34.29 | v47.62,51.44 47.62,50.27 C7.1 47.73,48.05 47.56,47.88 U1.48 | U1.13 36.22,41.88 36.51,41.59 36.51,39.79 36.62,39.79 | 30.27,38.31 C8.1 C23.1 35.14,38.31 36.62,39.79 | 30.27,38.31 v30.16,38.42 | R37.2 v55.56,44.45 | R38.2 v55.56,46.99 | R39.2 v55.56,49.53 | J2.1 v59.05,55.24 | C9.1 v35.24,50.16 37.52,50.16 U1.64 | v16.19,62.55 R34.2 | C2.1 57.78,35.51 | U1.19 38.52,39.26 38,39.79 36.62,39.79 | 60.33,24.13 C24.1 | IC4.2 52.33,24.19 52.39,24.13 52.33,24.07 IC4.3 | IC4.7 57.53,24.13 IC4.6 | C18.1 62.23,23.84 62.23,24.13 | R40.2 30.27,38.31
  Top 0.61: P1.1 57.78,35.51 56.02,35.51 C17.1 | SJ1.3 v26.67,9.84
  Top 1.016: 52.39,24.13 57.53,24.13 60.33,24.13 62.23,24.13 v63.88,24.13 v63.88,25.08 v63.88,26.04
  pour Bottom (isolate 0.254): -0.32,80.33 -0.32,0 0.32,-0.64 9.84,-0.64 12.06,1.59 12.06,7.94 13.02,8.89 26.99,8.89 27.94,7.94 27.94,1.59 30.16,-0.64 67.94,-0.64 67.94,80.96 0.32,80.96
+5V
  Top 0.305: 13.54,11.11 IC3.7 | PAD9.1 52.33,11.43 | C22.1 52.33,19.68
  Top 0.406: 14.76,10.95 14.61,11.11
  Top 0.508: 14.61,11.11 13.54,11.11
  Top 0.61: SJ1.1 21.46,9.34 14.92,9.34 | R20.2 52.33,17.46
  Top 0.813: 14.76,10.95 14.92,10.79 14.92,9.34 14.92,2.54 15.94,1.52 21.44,1.52 21.51,1.59 51.12,1.59 52.33,2.8 52.33,11.43 52.33,17.46 52.33,19.68 IC4.4
BB_1
  Top 0.305: U1.11 33.71,42.88 31.64,40.82 18.37,40.82 16.01,43.18 VD5.1 14.75,38.15 R31.1 | R31.1 | J3.1 R31.1
BB_2
  Top 0.305: U1.10 33.56,43.38 31.46,41.27 18.56,41.27 VD5.2 14.75,47.24 R32.1 12.33,50 J4.1
BB_3
  Top 0.305: U1.9 33.42,43.88 31.3,41.77 18.72,41.77 17.18,43.31 17.18,54.61 16.55,55.24 VD4.1 | J5.1 12.38,62 12.38,61.59 13.34,60.64 13.34,56.35 VD4.1 | VD4.1 14.92,54.76 R33.1
BB_4  (via drill 0.35)
  Top 0.305: U1.8 33.27,44.38 31.11,42.23 18.91,42.23 17.64,43.5 17.64,56.34 16.83,57.15 VD4.2 14.75,57.47 14.75,58.74 | v14.8,62.55 14.75,62.51 14.75,58.74 | R34.1 16.09,58.74 14.75,58.74 | v14.8,68.64 14.8,71.25 12.4,73.64 J6.1
  Bottom 0.305: v14.8,68.64 v14.8,62.55
BTN1
  Top 0.305: U1.40 52.61,43.88 54.37,45.64 54.37,49.92 55.24,50.8 58.42,50.8 | 58.42,50.8 61.86,50.8 P4.1 | R39.1 58.32,50.7 58.42,50.8
BTN2
  Top 0.305: U1.39 52.76,43.38 54.83,45.45 54.83,47.31 55.77,48.25 58.42,48.25 | 58.42,48.25 P4.3 | R38.1 58.32,48.15 58.42,48.25
BTN3
  Top 0.305: 58.42,45.75 55.77,45.75 52.91,42.88 U1.38 | 58.42,45.75 P4.5 | R37.1 58.32,45.65 58.42,45.75
DEBUG_LED
  Top 0.305: U1.36 50.93,41.88 R5.2
DEBUG_RX  (via drill 0.35)
  Top 0.305: U1.43 45.74,45.38 v45.4,45.72 | J2.9 54.23,60.33 53.02,59.12 53.02,54.61 52.07,53.66 52.07,49.53 v51.75,49.21
  Bottom 0.305: v45.4,45.72 42.81,48.31 42.81,48.91 43.22,49.31 51.66,49.31 v51.75,49.21
DEBUG_TX
  Top 0.305: U1.42 47.98,44.88 48.49,44.37 51.51,44.37 52.01,44.88 52.01,47.82 52.83,48.64 52.83,53.47 53.66,54.29 53.66,58.42 54.29,59.05 J2.7
DISP_CLK
  Top 0.305: U1.33 47.34,40.38 47.41,40.32 47.41,37.75 53.66,31.5 59.88,31.5 61.4,33.02 P1.3
DISP_CS
  Top 0.305: U1.34 46.28,40.88 46.04,40.64 46.04,37.72 53.28,30.48 61.88,30.48 P1.5
DISP_DC  (via drill 0.35)
  Top 0.305: U1.53 43.02,49.1 v43.5,48.63 | v46.72,38.48 46.72,37.73 53.47,30.99 60.52,30.99 61.29,31.76 P1.4
  Bottom 0.305: v43.5,48.63 45.67,48.63 46.61,47.69 46.61,38.48 v46.72,38.48
DISP_MOSI
  Top 0.305: P1.6 61.86,29.21 61.28,29.21 60.52,29.97 53.14,29.97 45.58,37.53 45.58,40.83 46.13,41.38 U1.35
GND  (via drill 0.35)
  Top 0.305: 44.52,39.69 U1.31 44.52,33.77 45.28,33.02 | U1.63 38.02,51.19 | U1.18 38.02,36.91 | U1.47 47.83,47.38 48.9,48.45 | v33.99,42.2 34.18,42.38 U1.12 37.31,42.38
  Top 0.61: P1.2 57.78,34.26 | 57.78,34.26 55.94,34.26 C17.2 | C2.2 57.78,34.26
  Bottom 0.305: v33.99,42.2 33.99,36.79 v32.58,35.37
  Bottom 0.61: v55.56,52.7 v49.53,52.7 | 23.14,35.15 v23.18,35.12 | v14.92,18.41 v14.92,16.19 | v36.83,31.43 v36.83,22.86 | v26.35,45.4 v26.35,50.48 | v13.65,18.41 v13.65,16.19
  Bottom 0.813: 23.14,35.15 16.51,35.15 v16.51,31.75 v16.51,27.94 | v24.45,35.12 v23.18,35.12
  other vias: 13.34,4.76 13.34,3.81 13.34,2.86 13.34,1.91 24.13,2.86 25.27,2.86 26.35,2.86 16.51,35.18 17.46,35.18 18.41,35.18
  pour Top (isolate 0.254, no thermals): -0.64,80.96 -0.64,-0.32 68.26,-0.32 68.26,80.96
  pour Bottom (no thermals): 12.51,1.59 13.14,0.95 26.86,0.95 27.5,1.59 27.5,7.75 26.73,8.51 13.27,8.51 12.51,7.75
JOYSTICK_W  (via drill 0.35)
  Top 0.305: U1.24 v41.02,22.61 | C30.1 R23.2 R22.1 49.74,12.38 49.74,16.04 v47.94,17.84
  Bottom 0.305: v47.94,17.84 43.18,22.61 v41.02,22.61
JOYSTICK_X
  Top 0.305: U1.15 33.05,40.88 32.02,39.85 21.21,39.85 20.18,38.82 20.18,34.8 19.11,33.73 7.05,33.73 6.17,34.61 6.17,48.4 6.21,48.44 6.21,66.23 7.11,67.13 34.61,67.13 | 34.61,67.13 34.61,70.38 J8.8 | 34.61,67.13 55.07,67.13 55.56,67.63 PAD12.1
JOYSTICK_Y
  Top 0.305: U1.16 33.2,40.38 32.21,39.4 21.4,39.4 20.64,38.63 20.64,34.61 19.3,33.27 6.73,33.27 5.71,34.29 5.71,66.38 6.92,67.59 27.9,67.59 28.57,68.26 28.57,70.41 J8.11
  Bottom 0.305: J8.11 28.5,68.02 28.89,67.63 51.75,67.63 PAD13.1
JOYSTICK_Z
  Top 0.305: U1.14 32.86,41.38 31.83,40.36 21.07,40.36 19.72,39.01 19.72,34.99 18.93,34.19 7.4,34.19 6.67,34.92 6.67,66.04 7.3,66.67 57.78,66.67 | P3.2 59.69,60.01 59.05,60.64 59.05,66.04 58.42,66.67 57.78,66.67 | PAD14.1 57.78,66.67
JTAG_JTCK
  Top 0.305: U1.49 45.02,55.82 45.72,56.52 J2.4
JTAG_JTDI
  Top 0.305: U1.50 44.52,58.49 45.09,59.05 J2.8
JTAG_JTDO  (via drill 0.35)
  Top 0.305: U1.55 42.02,49.1 43.18,47.94 44.45,47.94 45.48,48.98 45.48,55.31 v45.88,55.72 | v45.97,57.78 J2.6
  Bottom 0.305: v45.88,55.72 45.88,57.7 v45.97,57.78
JTAG_JTMS
  Top 0.305: U1.46 48.15,46.88 51.31,50.04 J2.2
JTAG_NRST  (via drill 0.35)
  Top 0.305: U1.7 33.12,44.88 30.93,42.69 19.1,42.69 18.1,43.69 18.1,60.96 | v47.94,62.55 50.16,60.33 J2.10 | 18.1,60.96 v18.1,62.55 | C1.1 18.22,60.83 18.1,60.96
  Bottom 0.305: v18.1,62.55 v47.94,62.55
LED1_G
  Top 0.305: U1.51 44.02,53.17 R1.2
LED1_R
  Top 0.305: U1.52 43.52,51.64 R6.2
LED2_G
  Top 0.305: U1.56 41.52,52.96 40.51,53.98 39.05,53.98 38.1,54.93 R2.2
LED2_R
  Top 0.305: U1.57 41.02,52.82 40.37,53.47 37.66,53.47 36.09,55.03 R7.2
LED3_G
  Top 0.305: U1.58 40.52,52.62 40.13,53.01 36.2,53.01 34.18,55.03 R3.2
LED3_R
  Top 0.305: U1.59 40.01,49.9 40.01,52.39 39.84,52.55 34.44,52.55 32,54.99 R8.2
LED4_G  (via drill 0.35)
  Top 0.305: U1.37 44.93,42.38 44.07,43.24 44.07,46.91 45.94,48.78 45.94,53.24 v46.61,53.91 | v31.03,53.89 29.97,54.94 R4.2
  Bottom 0.305: v31.03,53.89 31.05,53.91 v46.61,53.91
LED4_R  (via drill 0.35)
  Top 0.305: U1.41 45.22,44.38 44.64,44.96 44.64,46.74 46.48,48.58 46.48,52.96 v46.62,52.96 | v30.16,52.83 27.96,55.03 R9.2
  Bottom 0.305: v46.62,52.96 46.49,52.83 v30.16,52.83
N$1
  Top 0.305: U1.60 39.52,51.91 39.37,52.07 28.57,52.07 25.72,54.93 | 25.72,54.93 R30.2 | BOOT0.2 25.4,55.24 25.72,54.93
N$3
  Top 0.61: IC2.2 25.08,8.26 | 25.08,8.26 24.45,8.26 23.5,9.21 SJ1.2 | C4.1 25.27,8.06 25.08,8.26
N$4
  Top 0.305: IC2.4 33.66,3.17 42.55,12.06 48.36,12.06 R22.2
N$5
  Top 0.305: R5.1 LED1.A
N$6  (via drill 0.35)
  Top 0.305: U1.6 37,45.38 v37.08,45.47
  Bottom 0.305: v37.08,45.47 37.08,37.08 PAD1.1
N$7  (via drill 0.35)
  Top 0.305: U1.5 34.07,45.88 v34.04,45.85
  Bottom 0.305: PAD2.1 29.84,33.72 33.02,36.89 33.02,44.83 v34.04,45.85
N$8  (via drill 0.35)
  Top 0.305: U1.2 38.98,47.38 v38.99,47.37
  Bottom 0.305: v38.99,47.37 38.99,35.18 PAD3.1
N$9  (via drill 0.35)
  Top 0.305: U1.3 34.08,46.88 v33.97,46.99
  Bottom 0.305: PAD4.1 32.07,37.78 32.07,45.09 v33.97,46.99
N$10
  Top 0.305: IC3.4 19.13,15.32 20,16.19 21.63,16.19 R10.2
N$11
  Top 0.305: P2.12 28,60.37 28,56.79 R9.1
N$12  (via drill 0.35)
  Top 0.305: U1.4 37.96,46.38 v38.04,46.46
  Bottom 0.305: v38.04,46.46 38.04,36.13 PAD5.1
N$13
  Top 0.305: P2.10 30.37,60.25 30.37,57.13 R4.1
N$14
  Top 0.305: P2.9 31.88,56.86 R8.1
N$15
  Top 0.305: P2.7 34.38,57.07 R3.1
N$16
  Top 0.305: P2.6 35.62,57.17 R7.1
N$17
  Top 0.305: P2.4 38.12,56.76 R2.1
N$18
  Top 0.305: P2.3 39.38,57.49 R6.1
N$19
  Top 0.305: P2.1 41.88,57.02 R1.1
N$20  (via drill 0.35)
  Top 0.305: U1.17 36.23,38.38 v36.2,38.41
  Bottom 0.305: PAD6.1 31.83,33.66 33.1,34.92 33.66,34.92 36.2,37.47 v36.2,38.41
P5V_SUPPLY  (via drill 0.35)
  Top 0.305: U1.25 41.52,23.69 v41.72,23.5 | R21.2 R20.1 54.51,13.76 v54.61,13.65 | v50.48,13.65 50.48,16.51 v47.94,19.05
  Bottom 0.305: v54.61,13.65 v50.48,13.65 | v41.72,23.5 43.5,23.5 v47.94,19.05
RJ12_5V  (via drill 0.35)
  Top 0.305: U1.27 42.52,40 v42.54,40.01 | v37.81,20.92 37.78,20.95 24.49,20.95 R25.2 R24.1
  Bottom 0.305: v42.54,40.01 43.18,39.37 43.18,26.29 v37.81,20.92
RJ12_CLK
  Top 0.305: J1.4 10.48,21.59 9.66,22.4 9.66,29.86 10.61,30.8 VD3.1 23.81,30.8 24.77,29.84 37.79,29.84 39.52,31.58 U1.21
RJ12_CS
  Top 0.305: U1.20 39.02,31.72 37.6,30.3 25.41,30.3 23.01,32.7 VD3.2 10.16,32.7 9.21,31.75 9.21,21.27 10.16,20.32 J1.5
RJ12_MISO  (via drill 0.35)
  Top 0.254: R40.1 29.11,37.47 35.08,37.47 v35.24,37.63
  Top 0.305: J1.3 10.79,22.86 10.16,23.5 10.16,28.26 10.79,28.89 VD2.2 24.13,28.89 24.62,29.39 37.98,29.39 40.02,31.43 U1.22 40.01,38.4 v40.01,40.01
  Bottom 0.305: v40.01,40.01 40.01,47.62 39.05,48.58 36.2,48.58 35.24,47.62 v35.24,37.63
RJ12_MOSI
  Top 0.305: J1.2 11.02,24.13 10.67,24.48 10.67,26.54 11.12,26.99 VD2.1 23.01,26.99 24.91,28.89 38.13,28.89 40.52,31.28 U1.23
RJ12_PWR
  Top 0.305: C20.1 16.83,20.95 | R24.2 17.14,18.16
  Top 0.508: IC3.6 11.88,11.76 11.26,12.38
  Top 0.61: 11.26,12.38 VD6.2 | J1.1 14.64,25.78 18.35,25.78 PAD11.1
  Top 0.813: J1.1 16.83,22.54 16.83,20.95 16.83,17.84 | VD6.2 10.94,16.34 11.81,17.21 16.19,17.21 16.83,17.84 | 16.83,17.84 17.14,18.16
SCL
  Top 0.305: U1.61 39.02,48.93 38.54,48.45 26.99,48.45 24.57,46.04 IC1.6 21.8,46.04 R35.1
SDA
  Top 0.305: U1.62 38.52,49.13 38.3,48.91 26.05,48.91 24.45,47.31 IC1.5 23.75,48.41 23.39,48.77 R36.1
USB_5V  (via drill 0.35)
  Top 0.305: U1.26 42.02,31.95 v42.23,31.75 | IC3.3 21.38,11.76 R11.2 21.69,12.32 23.39,14.02 | 23.39,14.02 R15.1 | v25.4,17.14 25.4,14.92 24.45,13.97 23.44,13.97 23.39,14.02
  Bottom 0.305: v42.23,31.75 42.23,26.35 33.13,17.26 25.4,17.26 v25.4,17.14
USB_DM  (via drill 0.35)
  Top 0.305: VD1.2 50.78,45.91 49.68,45.91 v49.53,46.07 49.35,45.88 U1.44
  Bottom 0.305: v49.53,46.07 49.52,46.07
  Bottom 0.813: 49.52,46.07 49.52,15.86 48.59,14.94 10.02,14.94 8.19,13.1 8.19,11.11 8.19,8.83 7.62,8.26 5.08,8.26 4.13,7.3 4.13,6.35 4.34,6.13 J7.2
USB_DP  (via drill 0.35)
  Top 0.305: U1.45 48.88,46.38 49.72,47.22 v49.72,47.24 50.1,47.62 VD1.1
  Bottom 0.813: J7.3 8.51,5.33 9.21,6.03 9.21,12.75 10.42,13.97 49.02,13.97 50.48,15.43 50.48,46.48 v49.72,47.24
USB_PWR  (via drill 0.35)
  Top 0.305: v20.64,12.97 21.89,14.22 21.57,14.22 R15.2 | v10.16,7.94 10.94,7.94
  Top 0.508: IC3.8 10.97,10.46
  Top 0.61: 10.94,8.57 VD6.1 10.97,10.46 | 10.94,8.57 10.94,7.94 10.94,6.96 10.97,6.93 | 10.97,6.93 11.32,6.58 C15.2 10.96,6.54 10.96,4.6 PAD10.1 | C21.2 10.94,8.57 | J7.1 10.97,6.93
  Bottom 0.305: v20.64,12.97 20.59,13.02 10.79,13.02 10.16,12.38 v10.16,7.94
(copper drawn outside any net)
  shapes: Top area x1

### Text on the board
tNames: Joystick | Buddy4 | LED | JTAG | Poti | Buddy3 | Buttons | Buddy2 | Buddy1 | Display | 4D-Joystick / Joystick-Unit / REV 01